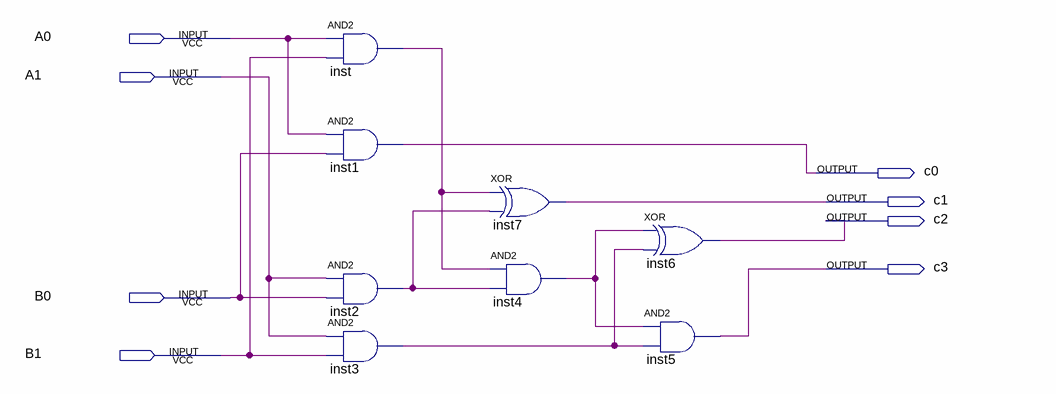
[diagram p0: schematic sheet]
// Quartus schematic multiply.bdf as structural Verilog: 8 symbols, 8 pins
module multiply (
  input  A0,
  input  A1,
  input  B0,
  input  B1,
  output c0,
  output c1,
  output c2,
  output c3
);

  wire inst2_out, inst3_out, inst4_out, inst_out;

  and inst (inst_out, A0, B1);
  and inst1 (c0, A0, B0);
  and inst2 (inst2_out, A1, B0);
  and inst3 (inst3_out, A1, B1);
  xor inst7 (c1, inst_out, inst2_out);
  and inst4 (inst4_out, inst_out, inst2_out);
  xor inst6 (c2, inst4_out, inst3_out);
  and inst5 (c3, inst4_out, inst3_out);
endmodule
